# EAGLE design MotorController-ControlCard (EAGLE 8.3.2)
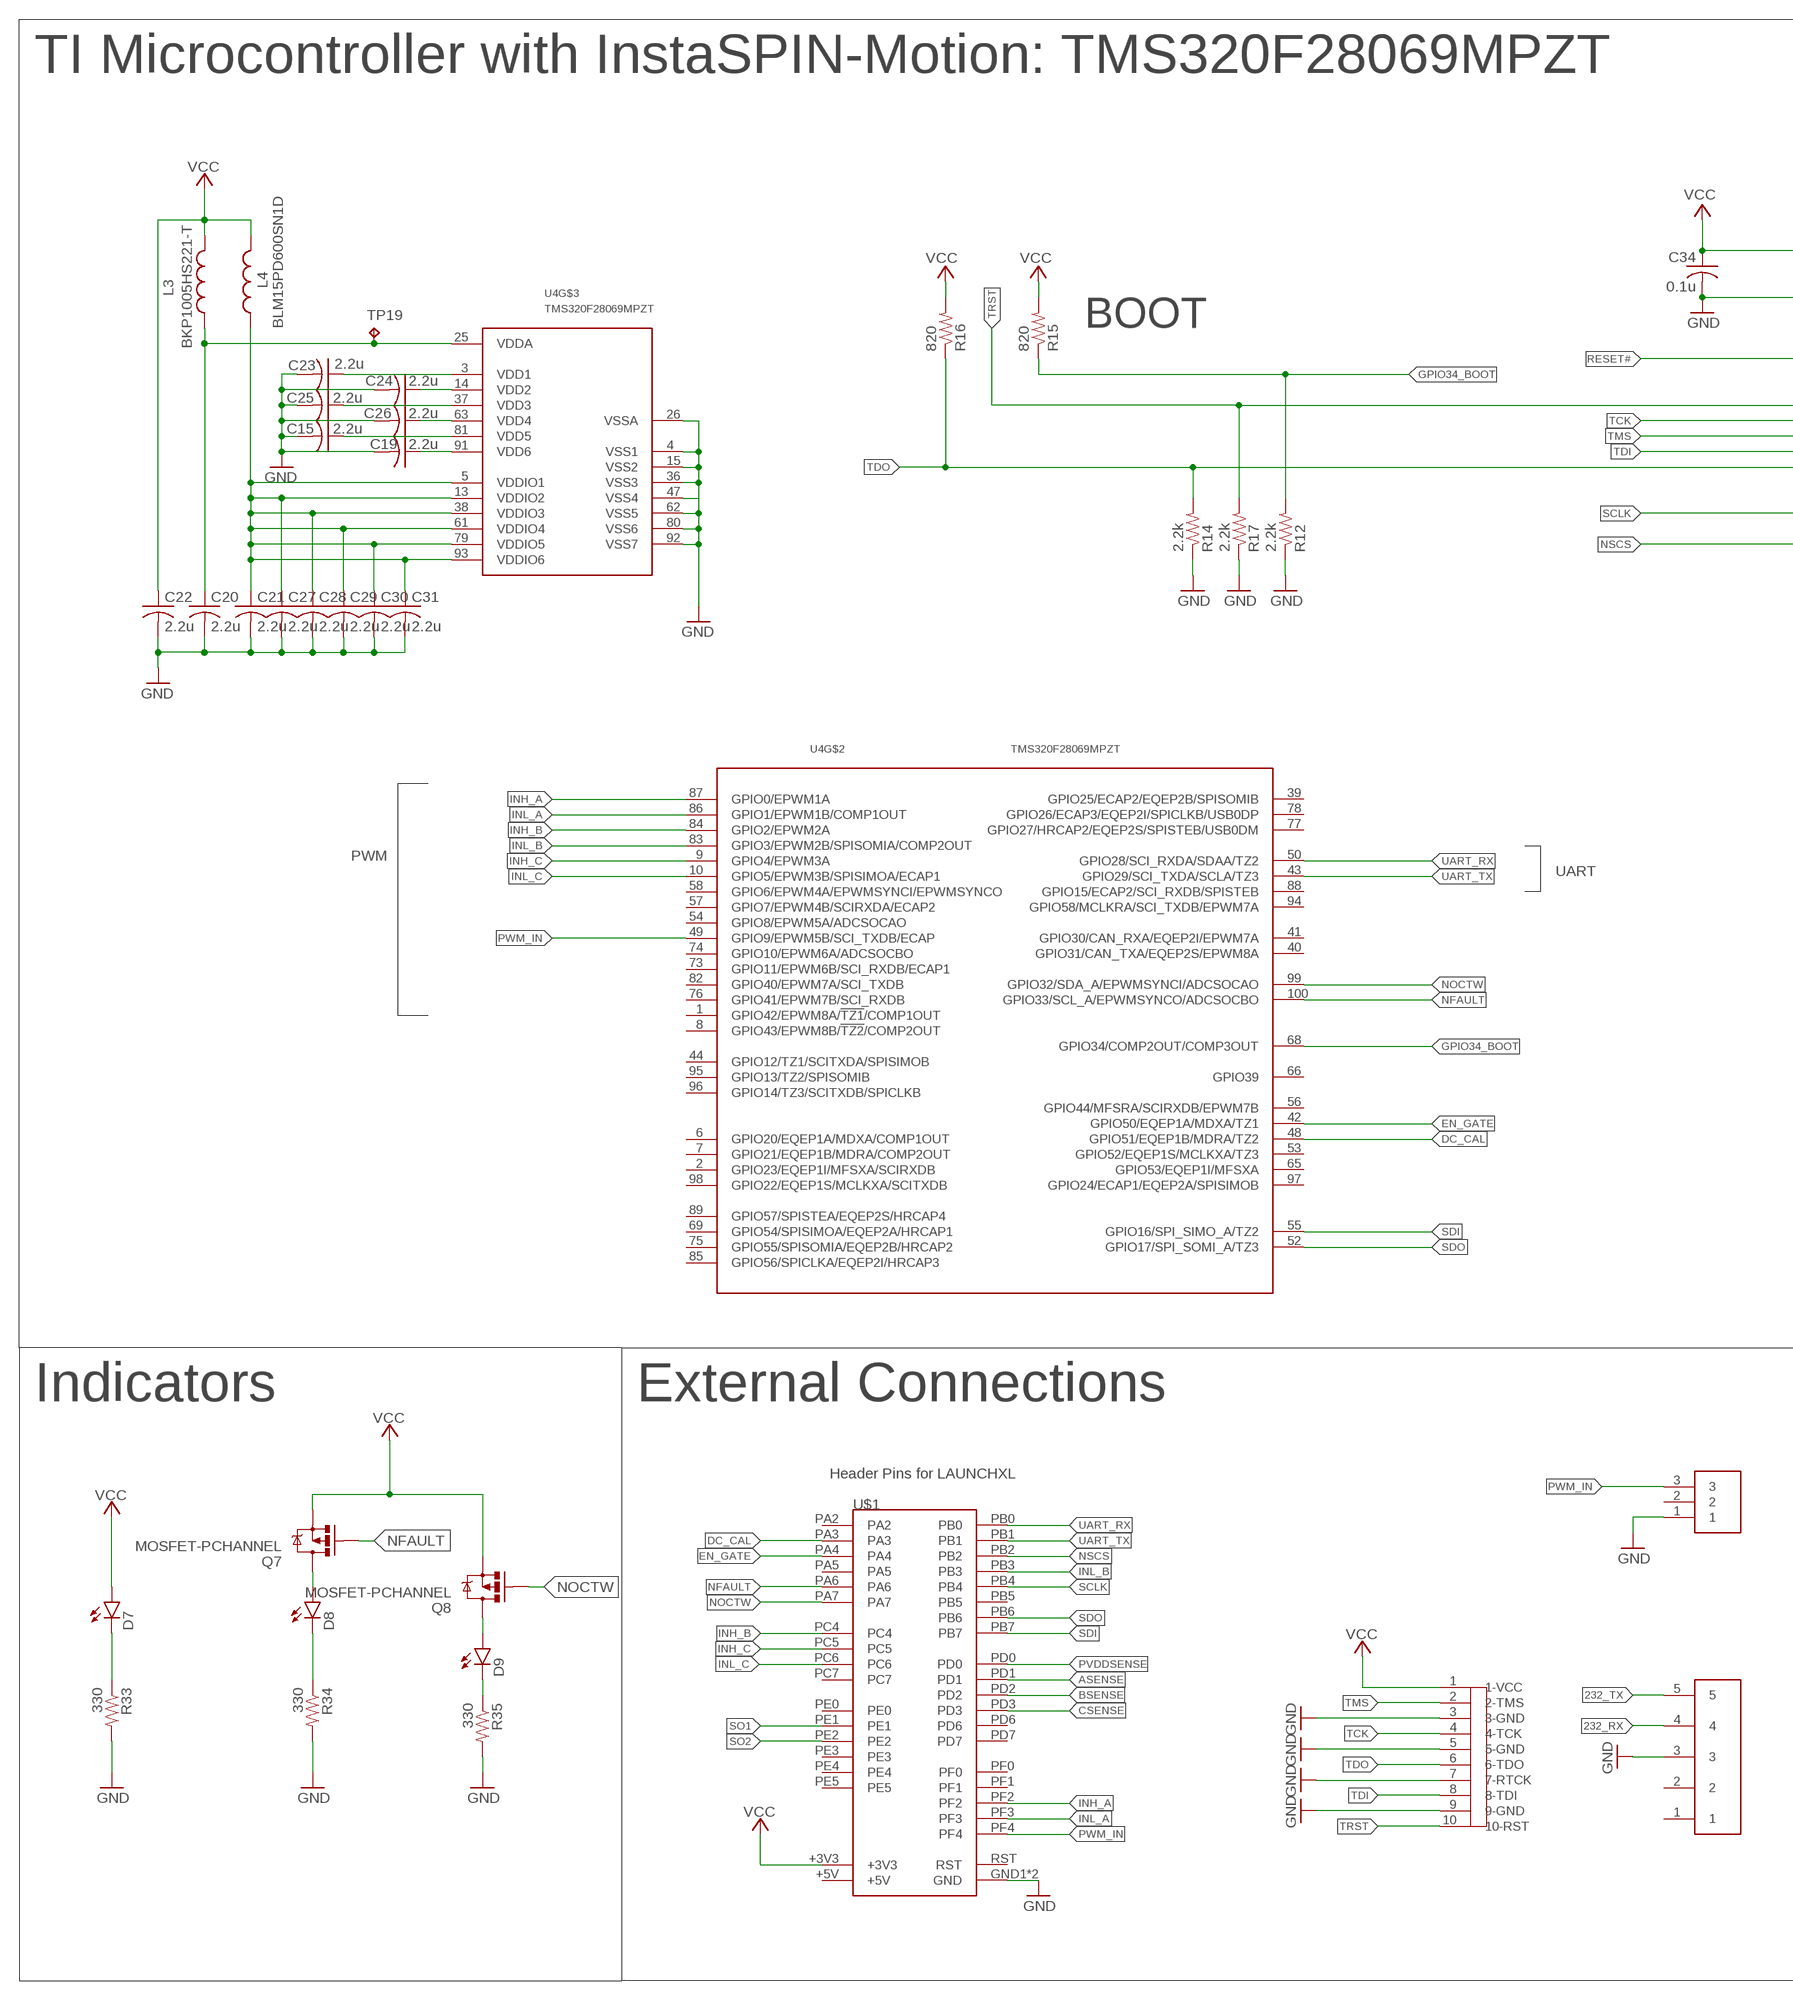
[diagram p0: schematic, sheet 1, part 1 of 2]
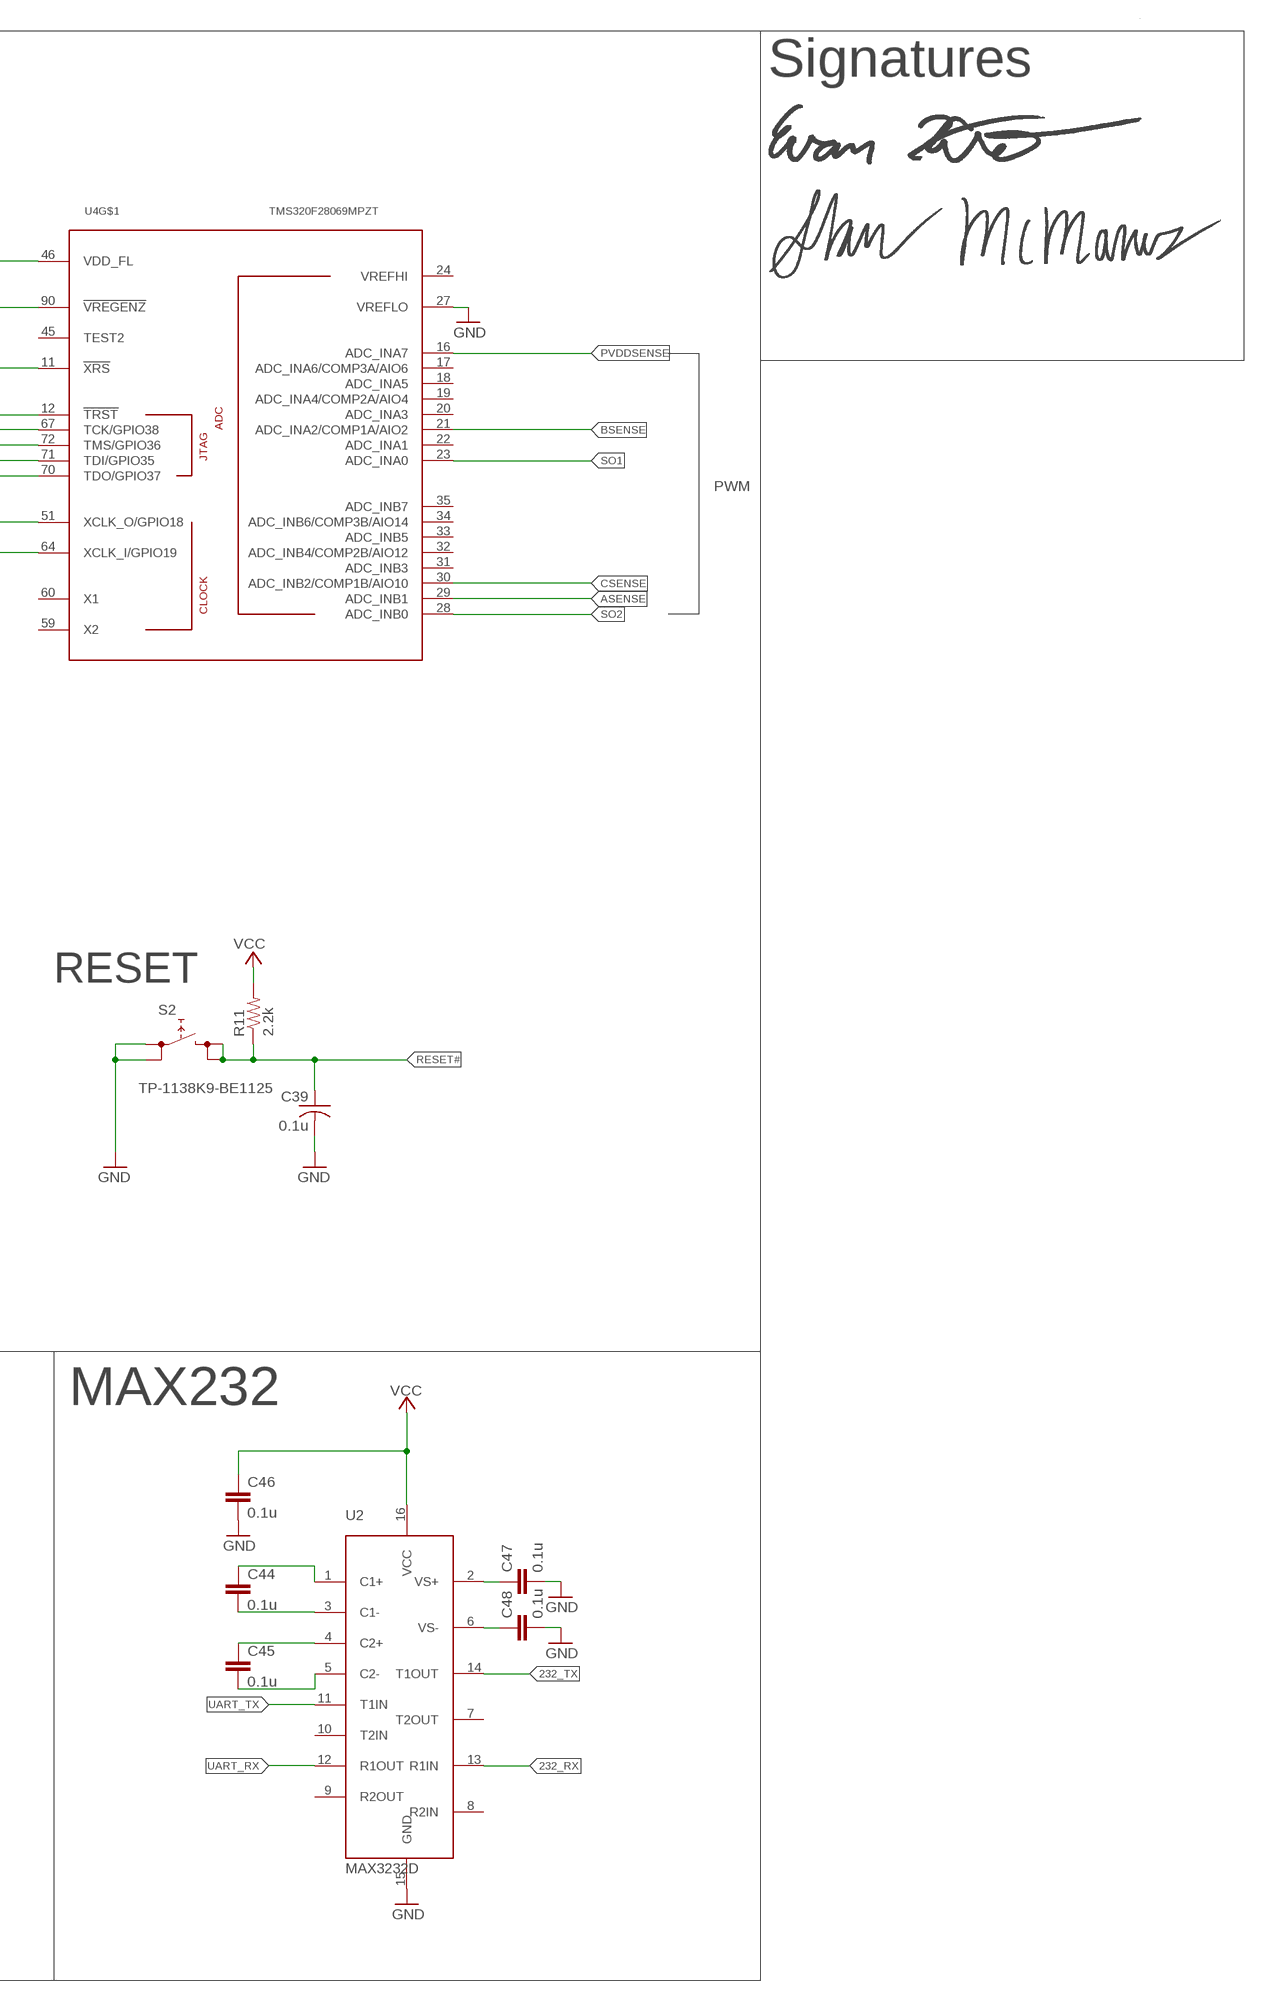
[diagram p1: schematic, sheet 1, part 2 of 2]

## Parts
C15  2.2u  C-USC0402  [C0402]
C19  2.2u  C-USC0402  [C0402]
C20  2.2u  C-USC0402  [C0402]
C21  2.2u  C-USC0402  [C0402]
C22  2.2u  C-USC0402  [C0402]
C23  2.2u  C-USC0402  [C0402]
C24  2.2u  C-USC0402  [C0402]
C25  2.2u  C-USC0402  [C0402]
C26  2.2u  C-USC0402  [C0402]
C27  2.2u  C-USC0402  [C0402]
C28  2.2u  C-USC0402  [C0402]
C29  2.2u  C-USC0402  [C0402]
C30  2.2u  C-USC0402  [C0402]
C31  2.2u  C-USC0402  [C0402]
C34  0.1u  C-USC0402  [C0402]
C39  0.1u  C-USC0402  [C0402]
C44  0.1u  CAP0805  [0805]
C45  0.1u  CAP0805  [0805]
C46  0.1u  CAP0805  [0805]
C47  0.1u  CAP0805  [0805]
C48  0.1u  CAP0805  [0805]
D7  LED1206  [LED-1206]
D8  LED1206  [LED-1206]
D9  LED1206  [LED-1206]
J2  SL03THROUGH_HOLE  [MOLEX_SL_03_TH]
L3  BKP1005HS221-T  L-US0402  [R0402]
L4  BLM15PD600SN1D  L-US0402  [R0402]
Q7  MOSFET-PCHANNEL  [SOT23-3]
Q8  MOSFET-PCHANNEL  [SOT23-3]
R11  2.2k  R-US_R0402  [R0402]
R12  2.2k  R-US_R0402  [R0402]
R14  2.2k  R-US_R0402  [R0402]
R15  820  R-US_R0402  [R0402]
R16  820  R-US_R0402  [R0402]
R17  2.2k  R-US_R0402  [R0402]
R33  330  RESISTOR0805-RES  [0805]
R34  330  RESISTOR0805-RES  [0805]
R35  330  RESISTOR0805-RES  [0805]
S2  TP-1138K9-BE1125  FSMJSMA  [FSMJSMA]
TP19  TESTPAD_TPB1,27  [TESTPAD_B1,27]
U2  MAX3232D  [SOIC16]
U4  TMS320F28069MPZT  TMS320F28069PZSR  [PQFP100]
U$1  TIVA-123  [TIVA-C]
U$2  IDC_BOX_HEADER_2X5_1.27MM  [1.27MM_2X5_BOX_HEADER_STRAIGHT]
U$3  EVAN_HITE_SIGNATURE  [EVAN_HITE_SIGNATURE]
U$4  5PIN  [5PIN]
U$5  SHAUN_MCMANUS_SIGNATURE  [SHAUN_MCMANUS_SIGNATURE]

## Nets
232_RX: U2.13(R1IN) U$4.4
232_TX: U2.14(T1OUT) U$4.5
+3V3: C22.1 C34.1 C46.1 D7.A L3.2 L4.2 Q7.2(S) Q8.2(S) R11.2 R15.2 R16.2 U2.16(VCC) U4.46(VDD_FL) U$1.+3V3 U$2.1(1-VCC) ; supply symbol labelled VCC
ASENSE: U4.29(ADC_INB1) U$1.PD1
BSENSE: U4.21(ADC_INA2/COMP1A/AIO2) U$1.PD2
CSENSE: U4.30(ADC_INB2/COMP1B/AIO10) U$1.PD3
DC_CAL: U4.48(GPIO51/EQEP1B/MDRA/TZ2) U$1.PA3
EN_GATE: U4.42(GPIO50/EQEP1A/MDXA/TZ1) U$1.PA4
GND: C15.2 C19.2 C20.2 C21.2 C22.2 C23.2 C24.2 C25.2 C26.2 C27.2 C28.2 C29.2 C30.2 C31.2 C34.2 C39.2 C46.2 C47.2 C48.2 J2.1 R12.1 R14.1 R17.1 R33.2 R34.2 R35.2 S2.P$1 S2.P$2 U2.15(GND) U4.4(VSS1) U4.15(VSS2) U4.26(VSSA) U4.27(VREFLO) U4.36(VSS3) U4.47(VSS4) U4.62(VSS5) U4.80(VSS6) U4.90(!VREGENZ) U4.92(VSS7) U$1.GND1(GND) U$1.GND2(GND) U$2.3(3-GND) U$2.5(5-GND) U$2.7(7-RTCK) U$2.9(9-GND) U$4.3
GPIO34_BOOT: R12.2 R15.1 U4.68(GPIO34/COMP2OUT/COMP3OUT)
INH_A: U4.87(GPIO0/EPWM1A) U$1.PF2
INH_B: U4.84(GPIO2/EPWM2A) U$1.PC4
INH_C: U4.9(GPIO4/EPWM3A) U$1.PC5
INL_A: U4.86(GPIO1/EPWM1B/COMP1OUT) U$1.PF3
INL_B: U4.83(GPIO3/EPWM2B/SPISOMIA/COMP2OUT) U$1.PB3
INL_C: U4.10(GPIO5/EPWM3B/SPISIMOA/ECAP1) U$1.PC6
N$13: C23.1 U4.3(VDD1)
N$14: C24.1 U4.14(VDD2)
N$15: C25.1 U4.37(VDD3)
N$16: C26.1 U4.63(VDD4)
N$17: C15.1 U4.81(VDD5)
N$24: D7.C R33.1
N$26: D8.C R34.1
N$27: D9.C R35.1
N$28: D9.A Q8.3(D)
N$32: D8.A Q7.3(D)
N$36: C19.1 U4.91(VDD6)
N$40: C44.1 U2.1(C1+)
N$42: C44.2 U2.3(C1-)
N$43: C45.1 U2.4(C2+)
N$44: C45.2 U2.5(C2-)
N$45: C48.1 U2.6(VS-)
N$46: C47.1 U2.2(VS+)
NFAULT: Q7.1(G) U4.100(GPIO33/SCL_A/EPWMSYNCO/ADCSOCBO) U$1.PA6
NOCTW: Q8.1(G) U4.99(GPIO32/SDA_A/EPWMSYNCI/ADCSOCAO) U$1.PA7
NSCS: U4.64(XCLK_I/GPIO19) U$1.PB2
PVDDSENSE: U4.16(ADC_INA7) U$1.PD0
PWM_IN: J2.3 U4.49(GPIO9/EPWM5B/SCI_TXDB/ECAP) U$1.PF4
RESET#: C39.1 R11.1 S2.P$3 S2.P$4 U4.11(!XRS)
SCLK: U4.51(XCLK_O/GPIO18) U$1.PB4
SDI: U4.55(GPIO16/SPI_SIMO_A/TZ2) U$1.PB7
SDO: U4.52(GPIO17/SPI_SOMI_A/TZ3) U$1.PB6
SO1: U4.23(ADC_INA0) U$1.PE1
SO2: U4.28(ADC_INB0) U$1.PE2
TCK: U4.67(TCK/GPIO38) U$2.4(4-TCK)
TDI: U4.71(TDI/GPIO35) U$2.8(8-TDI)
TDO: R14.2 R16.1 U4.70(TDO/GPIO37) U$2.6(6-TDO)
TMS: U4.72(TMS/GPIO36) U$2.2(2-TMS)
TRST: R17.2 U4.12(!TRST) U$2.10(10-RST)
UART_RX: U2.12(R1OUT) U4.50(GPIO28/SCI_RXDA/SDAA/TZ2) U$1.PB0
UART_TX: U2.11(T1IN) U4.43(GPIO29/SCI_TXDA/SCLA/TZ3) U$1.PB1
VDDA: C20.1 L3.1 TP19.TP U4.25(VDDA)
VDDIO: C21.1 C27.1 C28.1 C29.1 C30.1 C31.1 L4.1 U4.5(VDDIO1) U4.13(VDDIO2) U4.38(VDDIO3) U4.61(VDDIO4) U4.79(VDDIO5) U4.93(VDDIO6)
Unconnected: J2.2 U2.7(T2OUT) U2.8(R2IN) U2.9(R2OUT) U2.10(T2IN) U4.1(GPIO42/EPWM8A/!TZ1!/COMP1OUT) U4.2(GPIO23/EQEP1I/MFSXA/SCIRXDB) U4.6(GPIO20/EQEP1A/MDXA/COMP1OUT) U4.7(GPIO21/EQEP1B/MDRA/COMP2OUT) U4.8(GPIO43/EPWM8B/!TZ2!/COMP2OUT) U4.17(ADC_INA6/COMP3A/AIO6) U4.18(ADC_INA5) U4.19(ADC_INA4/COMP2A/AIO4) U4.20(ADC_INA3) U4.22(ADC_INA1) U4.24(VREFHI) U4.31(ADC_INB3) U4.32(ADC_INB4/COMP2B/AIO12) U4.33(ADC_INB5) U4.34(ADC_INB6/COMP3B/AIO14) U4.35(ADC_INB7) U4.39(GPIO25/ECAP2/EQEP2B/SPISOMIB) U4.40(GPIO31/CAN_TXA/EQEP2S/EPWM8A) U4.41(GPIO30/CAN_RXA/EQEP2I/EPWM7A) U4.44(GPIO12/TZ1/SCITXDA/SPISIMOB) U4.45(TEST2) U4.53(GPIO52/EQEP1S/MCLKXA/TZ3) U4.54(GPIO8/EPWM5A/ADCSOCAO) U4.56(GPIO44/MFSRA/SCIRXDB/EPWM7B) U4.57(GPIO7/EPWM4B/SCIRXDA/ECAP2) U4.58(GPIO6/EPWM4A/EPWMSYNCI/EPWMSYNCO) U4.59(X2) U4.60(X1) U4.65(GPIO53/EQEP1I/MFSXA) U4.66(GPIO39) U4.69(GPIO54/SPISIMOA/EQEP2A/HRCAP1) U4.73(GPIO11/EPWM6B/SCI_RXDB/ECAP1) U4.74(GPIO10/EPWM6A/ADCSOCBO) U4.75(GPIO55/SPISOMIA/EQEP2B/HRCAP2) U4.76(GPIO41/EPWM7B/SCI_RXDB) U4.77(GPIO27/HRCAP2/EQEP2S/SPISTEB/USB0DM) U4.78(GPIO26/ECAP3/EQEP2I/SPICLKB/USB0DP) U4.82(GPIO40/EPWM7A/SCI_TXDB) U4.85(GPIO56/SPICLKA/EQEP2I/HRCAP3) U4.88(GPIO15/ECAP2/SCI_RXDB/SPISTEB) U4.89(GPIO57/SPISTEA/EQEP2S/HRCAP4) U4.94(GPIO58/MCLKRA/SCI_TXDB/EPWM7A) U4.95(GPIO13/TZ2/SPISOMIB) U4.96(GPIO14/TZ3/SCITXDB/SPICLKB) U4.97(GPIO24/ECAP1/EQEP2A/SPISIMOB) U4.98(GPIO22/EQEP1S/MCLKXA/SCITXDB) U$1.PA2 U$1.PA5 U$1.PB5 U$1.PC7 U$1.PD6 U$1.PD7 U$1.PE0 U$1.PE3 U$1.PE4 U$1.PE5 U$1.PF0 U$1.PF1 U$4.1 U$4.2

## Notes on the sheet
- TI Microcontroller with InstaSPIN-Motion: TMS320F28069MPZT | Signatures
- BOOT
- PWM
- PWM
- UART
- RESET
- Indicators | External Connections | MAX232
- Header Pins for LAUNCHXL

## Power pins joined to a net without a drawn wire
+5V: U$1.+5V
RST: U$1.RST

## Library data of the parts
C15 C19-C31 C34 C39 = rcl:C-US: CAPACITOR, American symbol
C44-C48 = SparkFun-Passives:CAP: Capacitor Standard 0603 ceramic capacitor, and 0.1" leaded capacitor.
D7-D9 = SparkFun-LED:LED: LEDs Standard schematic elements and footprints for 5mm, 3mm, 1206, and 0603 sized LEDs. 5mm - Spark Fun Electronics SKU : COM-00529 (and others)
J2 = MRDT-Connectors:SL03: Molex 3-pin SL connector Locking 3 pin connector with standard header spacing. Backward compatible with standard RC servo connectors.; ORIENT: HORIZ; PARTNO: 0705550002
L3 L4 = rcl:L-US: INDUCTOR, American symbol
Q7 Q8 = SparkFun-DiscreteSemi:MOSFET-PCHANNEL: Generic PMOSFET IRLML2244 - TRANS-11153 (SOT-23 -20V -4.3A) (1.Gate 2.Source 3.Drain) FQP27P06 - COM-10349 <http://www.sparkfun.com/products/10349> (TO-220 -60V -27A) (1.Gate 2.Source 3.Drain); PROD_ID: TRANS-08285
R11 R12 R14-R17 = rcl:R-US_: RESISTOR, American symbol
R33-R35 = SparkFun-Passives:RESISTOR: Resistor Basic schematic elements and footprints for 0603, 1206, and PTH resistors.
S2 = switch:FSMJSMA
TP19 = RF430FRL152H_EVM_a:TESTPAD_TP: Test pad
U2 = MRDT-ICs:MAX*232; OPERATING_VOLTAGE: 3V3
U4 = LAUNCHXL-F28027:TMS320F28069PZS
U$1 = MRDT-Microcontrollers:TIVA-123: TIVA-C DEV BOARD (NON-CONNECTED)
U$2 = MRDT-Connectors:IDC_BOX_HEADER_2X5_1.27MM: 1175-1733-ND
U$3 = MRDT-Signatures:EVAN_HITE_SIGNATURE
U$4 = Molex-SL:5PIN
U$5 = MRDT-Signatures:SHAUN_MCMANUS_SIGNATURE

## Net classes
0 default: width 0.152 mm, drill 0.305 mm, clearance 0.152 mm

## Board
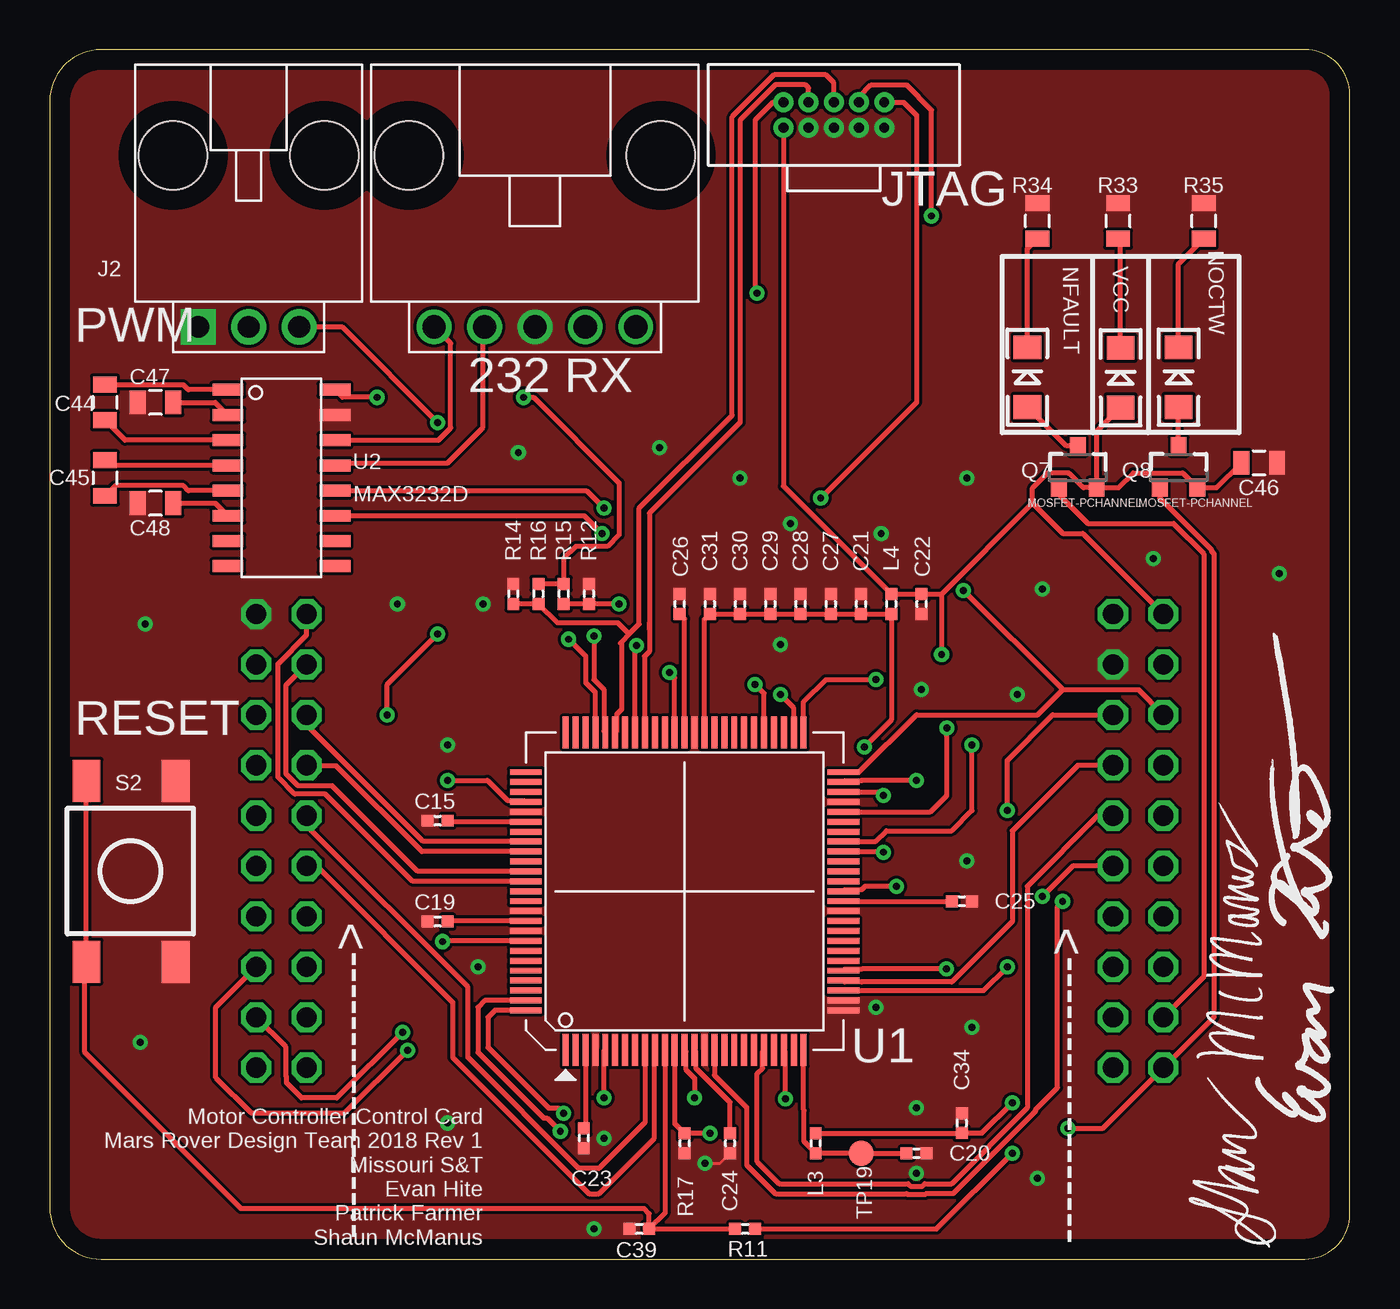
[diagram p2: board, top side]
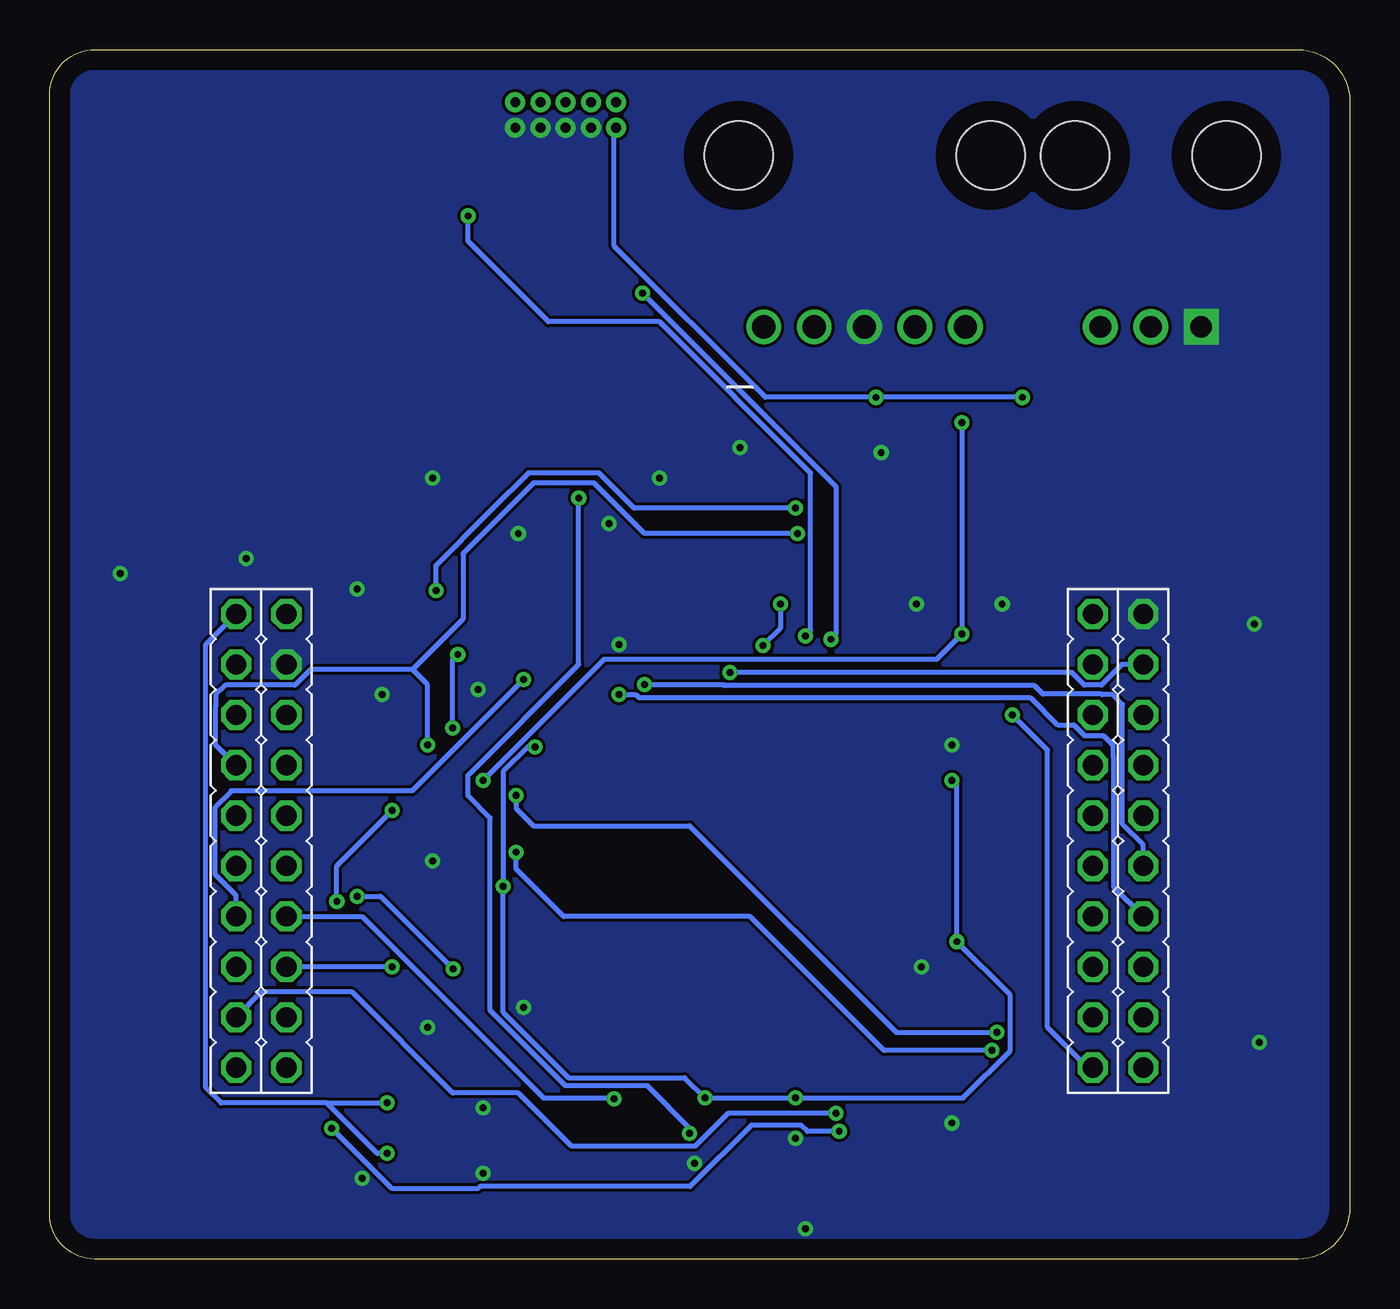
[diagram p3: board, bottom side, seen from below]

Size 65.53 x 60.96 mm. Coordinates in mm from the lower left corner, seen from the top.
Outline: 2.6,0 63.25,0 arc90 65.53,2.29 65.53,58.67 arc90 63.25,60.96 2.6,60.96 arc90 0,58.36 0,2.6 arc90 2.6,0
Copper layers (1*16): Top 0.035mm / dielectric 1.5mm / Bottom 0.035mm
Design rules "advanced_circuits_standard": minimum track width 5mil, minimum drill 10mil, track to track 5mil, track to pad 5mil, pad to pad 5mil, via to via 5mil, smd to smd 5mil, copper to edge 40mil, drill to drill 5mil, minimum pad ring 10mil, minimum via ring 8mil, stop-mask expansion 4mil, vias tented up to drill 0mil, thermal gap 10mil

### Footprints (pad centres in the part's own frame; a part is rotated, then mirrored left to right if it is on the bottom)
C0402 = smd 0.6 x 0.6: 1 -0.5,0; 2 0.5,0
0805 = smd 0.8 x 1.2: 1 -0.9,0; 2 0.9,0
LED-1206 = smd 1.2 x 1.4: A -1.5,0; C 1.5,0
MOLEX_SL_03_TH = drill 1.092 pad 1.778 square: 1 -2.54,0 | drill 1.092 pad 1.778: 2 0,0; 3 2.54,0 | hole 3.454: -3.81,8.636; 3.81,8.636
R0402 = smd 0.6 x 0.6: 1 -0.5,0; 2 0.5,0
SOT23-3 = smd 0.8 x 0.9: 1 -0.95,-1; 2 0.95,-1; 3 0,1.1
FSMJSMA = smd 1.397 x 2.108: P$1 0,0; P$2 0,-9.119; P$3 4.496,0; P$4 4.496,-9.119
TESTPAD_B1,27 = smd 1.27 x 1.27: TP 0,0
SOIC16 = smd 0.6 x 1.55: 1 -4.445,-2.7; 2 -3.175,-2.7; 3 -1.905,-2.7; 4 -0.635,-2.7; 5 0.635,-2.7; 6 1.905,-2.7; 7 3.175,-2.7; 8 4.445,-2.7; 9 4.445,2.7; 10 3.175,2.7; 11 1.905,2.7; 12 0.635,2.7; 13 -0.635,2.7; 14 -1.905,2.7; 15 -3.175,2.7; 16 -4.445,2.7
PQFP100 = smd 1.6 x 0.3: 1 -8,6; 2 -8,5.5; 3 -8,5; 4 -8,4.5; 5 -8,4; 6 -8,3.5; 7 -8,3; 8 -8,2.5; 9 -8,2; 10 -8,1.5; 11 -8,1; 12 -8,0.5; 13 -8,0; 14 -8,-0.5; 15 -8,-1; 16 -8,-1.5; 17 -8,-2; 18 -8,-2.5; 19 -8,-3; 20 -8,-3.5; 21 -8,-4; 22 -8,-4.5; 23 -8,-5; 24 -8,-5.5; 25 -8,-6; 51 8,-6; 52 8,-5.5; 53 8,-5; 54 8,-4.5; 55 8,-4; 56 8,-3.5; 57 8,-3; 58 8,-2.5; 59 8,-2; 60 8,-1.5; 61 8,-1; 62 8,-0.5; 63 8,0; 64 8,0.5; 65 8,1; 66 8,1.5; 67 8,2; 68 8,2.5; 69 8,3; 70 8,3.5; 71 8,4; 72 8,4.5; 73 8,5; 74 8,5.5; 75 8,6 | smd 0.3 x 1.6: 26 -6,-8; 27 -5.5,-8; 28 -5,-8; 29 -4.5,-8; 30 -4,-8; 31 -3.5,-8; 32 -3,-8; 33 -2.5,-8; 34 -2,-8; 35 -1.5,-8; 36 -1,-8; 37 -0.5,-8; 38 0,-8; 39 0.5,-8; 40 1,-8; 41 1.5,-8; 42 2,-8; 43 2.5,-8; 44 3,-8; 45 3.5,-8; 46 4,-8; 47 4.5,-8; 48 5,-8; 49 5.5,-8; 50 6,-8; 76 6,8; 77 5.5,8; 78 5,8; 79 4.5,8; 80 4,8; 81 3.5,8; 82 3,8; 83 2.5,8; 84 2,8; 85 1.5,8; 86 1,8; 87 0.5,8; 88 0,8; 89 -0.5,8; 90 -1,8; 91 -1.5,8; 92 -2,8; 93 -2.5,8; 94 -3,8; 95 -3.5,8; 96 -4,8; 97 -4.5,8; 98 -5,8; 99 -5.5,8; 100 -6,8
TIVA-C = drill 1.016 octagon: +3V3 30.48,2.54; +5V 30.48,5.08; GND1 33.02,5.08; GND2 30.48,48.26; PA2 53.34,48.26; PA3 50.8,48.26; PA4 48.26,48.26; PA5 48.26,2.54; PA6 50.8,2.54; PA7 53.34,2.54; PB0 35.56,2.54; PB1 38.1,2.54; PB2 33.02,48.26; PB3 35.56,45.72; PB4 45.72,2.54; PB5 33.02,2.54; PB6 45.72,48.26; PB7 43.18,48.26; PC4 38.1,45.72; PC5 40.64,45.72; PC6 43.18,45.72; PC7 45.72,45.72; PD0 35.56,5.08; PD1 38.1,5.08; PD2 40.64,5.08; PD3 43.18,5.08; PD6 48.26,45.72; PD7 50.8,45.72; PE0 35.56,48.26; PE1 45.72,5.08; PE2 48.26,5.08; PE3 50.8,5.08; PE4 40.64,2.54; PE5 43.18,2.54; PF0 38.1,48.26; PF1 53.34,5.08; PF2 30.48,45.72; PF3 33.02,45.72; PF4 53.34,45.72; RST 40.64,48.26
1.27MM_2X5_BOX_HEADER_STRAIGHT = drill 0.5: 1 1.915,8.865; 2 3.185,8.865; 3 1.915,7.595; 4 3.185,7.595; 5 1.915,6.325; 6 3.185,6.325; 7 1.915,5.055; 8 3.185,5.055; 9 1.915,3.785; 10 3.185,3.785
5PIN = drill 1.168: 1 5.08,0; 2 2.54,0; 3 0,0; 4 -2.54,0; 5 -5.08,0 | hole 3.454: -6.35,8.636; 6.35,8.636

### Placement (x,y rotation side)
C15  19.56,22.1 180 top
C19  19.56,17.02 180 top
C20  43.69,5.33 0 top
C21  40.89,33.02 90 top
C22  43.94,33.02 270 top
C23  26.92,6.1 270 top
C24  34.29,5.84 270 top
C25  45.97,18.03 0 top
C26  31.75,33.02 90 top
C27  39.37,33.02 90 top
C28  37.85,33.02 90 top
C29  36.32,33.02 90 top
C30  34.8,33.02 90 top
C31  33.27,33.02 90 top
C34  45.97,6.86 90 top
C39  29.72,1.52 180 top
C44  2.79,43.18 270 top
C45  2.79,39.37 270 top
C46  60.96,40.13 0 top
C47  5.33,43.18 180 top
C48  5.33,38.1 180 top
D7  53.97,44.42 90 top
D8  49.28,44.45 90 top
D9  56.9,44.45 90 top
J2  10.03,46.99 0 top
L3  38.61,5.84 90 top
L4  42.42,33.02 90 top
Q7  51.82,39.88 0 top
Q8  56.9,39.88 0 top
R11  35.05,1.52 0 top
R12  27.18,33.53 270 top
R14  23.37,33.53 270 top
R15  25.91,33.53 90 top
R16  24.64,33.53 90 top
R17  32,5.84 90 top
R33  53.85,52.32 90 top
R34  49.78,52.32 90 top
R35  58.17,52.32 90 top
S2  6.35,14.99 180 top
TP19  40.89,5.33 270 top
U2  11.68,39.37 270 top
U4  32,18.54 90 top
U$1  58.67,62.99 270 bottom
U$2  45.85,55.12 90 top
U$3  65.53,6.86 90 top
U$4  24.46,46.99 0 top
U$5  62.74,-0.25 90 top

### Tracks (layer width: path | path; a pad name or v marks a point on that pad's centre or on a via)
232_RX
  Top 0.254: U2.13 14.51,40.13 20.07,40.13 21.84,41.91 21.84,46.91 U$4.4
232_TX
  Top 0.254: U2.14 19.6,41.27 20.22,41.89 20.22,46.16 U$4.5
+3V3  (via drill 0.35)
  Top 0.254: R16.2 R15.2 25.91,35.31 26.52,35.92 28.11,35.92 28.7,36.51 28.7,39.12 24.38,43.43 v23.88,43.43 | v16.51,43.43 14.77,43.43 U2.16 | Q7.2 52.77,41.72 D7.A | C46.1 58.81,38.88 Q8.2 57.1,39.62 54.61,39.62 53.86,38.88 Q7.2 | Q7.2 52.11,38.88 51.38,39.61 51.33,39.61 51.31,39.62 50.29,39.62 49.53,38.86 49.53,38.1 | 49.53,38.1 51.05,36.58 52.07,36.58 U$1.+3V3 | 44.96,33.53 44.95,33.52 C22.1 L4.2 36.98,38.96 U$2.1 | 44.96,33.53 49.53,38.1 | U4.46 44.39,22.54 45.21,23.37 v45.21,26.77 | v44.96,30.48 44.96,33.53 | v48.51,7.87 47,6.36 C34.1 45.96,6.34 L3.2 | R11.2 44.7,1.52 v48.51,5.33
  Bottom 0.254: v16.51,43.43 v23.88,43.43 29.46,43.43 37.08,51.05 37.08,56.93 U$2.1 | v45.21,26.77 45.21,30.23 v44.96,30.48 | 51.56,7.87 v48.51,7.87 | 51.56,7.87 56.9,7.87 57.66,8.64 57.66,30.99 U$1.+3V3 | v48.51,5.33 49.02,5.33 51.56,7.87
ASENSE
  Top 0.254: U$1.PD1 51.82,24.89 48.51,21.59 48.51,17.02 45.47,13.97 40.92,13.97 40.08,13.97 U4.29
BSENSE
  Top 0.254: U$1.PD2 52.83,22.35 49.28,18.8 49.28,7.62 45.47,3.81 44.11,3.81 43.96,3.66 43.42,3.66 43.27,3.81 36.76,3.81 35.66,4.91 35.66,9.35 35.93,9.63 35.93,10.47 U4.21
CSENSE  (via drill 0.35)
  Top 0.254: U$1.PD3 51.56,19.81 v50.04,18.29 | v45.19,14.63 40.94,14.63 40.92,14.61 40.08,14.61 U4.30
  Bottom 0.254: v50.04,18.29 48.85,18.29 v45.19,14.63
DC_CAL  (via drill 0.35)
  Top 0.254: U4.48 41.84,23.54 v42.01,23.37 | v17.78,11.43 14.48,8.13 12.7,8.13 11.94,8.89 11.94,9.2 11.91,9.22 11.91,10.69 U$1.PA3
  Bottom 0.254: v42.01,23.37 42.01,22.71 41.15,21.84 33.27,21.84 22.86,11.43 v17.78,11.43
EN_GATE  (via drill 0.35)
  Top 0.254: U4.42 41.98,20.54 v42.01,20.51 | U$1.PA4 8.38,12.7 8.38,9.14 10.16,7.37 14.88,7.37 v18.03,10.52
  Bottom 0.254: v42.01,20.51 42.01,19.66 39.62,17.27 30.23,17.27 23.47,10.52 v18.03,10.52
GND  (via drill 0.35)
  Top 0.152: v33.02,4.83 33.77,4.83 C24.2
  other vias: 27.94,6.1 27.43,1.52 43.69,7.62 43.69,4.32 49.78,4.06 23.62,40.64 30.73,40.89 34.8,39.37 46.23,39.37 41.91,36.58 55.63,35.31 61.98,34.54 43.94,28.7 48.77,28.45 46.23,20.07 46.48,11.68 20.07,6.86 21.59,14.73 20.07,25.91 17.53,33.02 4.83,32 4.57,10.92 50.04,33.78 41.66,12.7 36.83,30.99 37.34,37.08 21.84,33.02
  pour Top (no thermals): -76.71,75.95 108.71,75.95 108.71,-53.34 -76.71,-53.34
  pour Bottom (no thermals): -109.47,-74.93 131.83,-74.17 133.1,87.63 -108.2,86.87
GPIO34_BOOT  (via drill 0.35)
  Top 0.254: R15.1 R12.2 v28.7,33.02 | 29.61,30.88 29.76,30.74 | 29.61,30.88 v29.57,30.92 | U4.68 29.5,30.77 29.61,30.88
  Bottom 0.254: v28.7,33.02 28.7,31.79 v29.57,30.92
INH_A
  Top 0.254: U4.87 18.3,19.04 13.89,23.44 12.35,23.44 11.51,24.29 11.51,30 12.95,31.45 U$1.PF2
INH_B
  Top 0.254: U4.84 18.76,20.54 14.45,24.86 12.99,24.86 U$1.PC4
INH_C
  Top 0.254: U4.9 30,6.89 27.69,4.57 26.67,4.57 21.08,10.16 21.08,13.72 12.95,21.84 U$1.PC5
INL_A
  Top 0.254: U4.86 18.56,19.54 14.25,23.85 12.52,23.85 11.91,24.46 11.91,28.93 12.45,29.46 12.57,29.59 U$1.PF3
INL_B
  Top 0.254: U$1.PB3 12.95,26.92 18.8,21.08 23.96,21.08 U4.83
INL_C
  Top 0.254: U$1.PC6 13.46,19.81 20.32,12.95 20.32,10.16 27.18,3.3 27.69,3.3 30.48,6.1 30.48,10.52 U4.10
N$13
  Top 0.254: U4.3 27,6.68 C23.1
N$14
  Top 0.254: U4.14 32.58,10.47 32.58,9.63 34.29,7.91 C24.1
N$15
  Top 0.254: U4.37 45.47,18.04 C25.1
N$16
  Top 0.254: U4.63 32,32.27 C26.1
N$17
  Top 0.254: U4.81 20.11,22.04 C15.1
N$24
  Top 0.254: D7.C 53.97,51.3 R33.1
N$26
  Top 0.254: D8.C 49.28,50.92 R34.1
N$27
  Top 0.254: D9.C 56.9,50.15 R35.1
N$28
  Top 0.254: Q8.3 D9.A
N$32
  Top 0.254: Q7.3 51.25,40.98 D8.A
N$36
  Top 0.254: U4.91 20.08,17.04 C19.1
N$40
  Top 0.254: U2.1 6.99,43.82 6.75,44.06 2.81,44.06 C44.1
N$42
  Top 0.254: U2.3 3.8,41.27 C44.2
N$43
  Top 0.254: U2.4 3.06,40.01 C45.1
N$44
  Top 0.254: U2.5 6.99,38.74 6.75,38.98 3.3,38.98 C45.2
N$45
  Top 0.254: C48.1 8.35,38.1 U2.6
N$46
  Top 0.254: C47.1 8.35,43.18 U2.2
NFAULT  (via drill 0.35)
  Top 0.254: Q7.1 50.87,38.54 52.32,37.08 56.64,37.08 58.17,35.56 58.17,14.22 U$1.PA6 | U4.100 22.45,12.54 22.1,12.19 22.1,10.67 25.15,7.62 25.63,7.62 v25.91,7.34
  Bottom 0.254: v25.91,7.34 31.35,7.34 33,5.69 39.22,5.69 41.91,8.38 45.21,8.38 50.29,13.46 54.86,13.46 U$1.PA6
NOCTW  (via drill 0.35)
  Top 0.254: Q8.1 55.95,38.35 58.57,35.73 58.57,35.66 58.67,35.56 58.67,12.19 56.26,9.78 | 56.26,9.78 U$1.PA7 | U4.99 21.93,13.04 21.59,12.7 21.59,10.41 24.89,7.11 25.06,7.11 v25.74,6.43 | v51.31,6.6 53.09,6.6 56.26,9.78
  Bottom 0.254: v25.74,6.43 27.35,6.43 27.67,6.75 30.16,6.75 33.26,3.66 43.84,3.66 43.94,3.56 48.26,3.56 v51.31,6.6
NSCS  (via drill 0.35)
  Top 0.254: U4.64 31.5,29.31 v31.24,29.57
  Bottom 0.254: U$1.PB2 11.48,29.97 12.52,28.93 13.39,28.93 14.02,29.57 v31.24,29.57
PVDDSENSE  (via drill 0.35)
  Top 0.254: U$1.PD0 50.55,27.43 48.26,25.15 v48.26,22.61 | U4.16 33.5,9.27 35.12,7.65 35.12,4.76 36.58,3.3 43.2,3.3 43.25,3.25 44.13,3.25 44.18,3.3 45.53,3.3 49.68,7.45 49.68,7.52 50.8,8.64 50.8,17.78 v51.05,18.03
  Bottom 0.254: v51.05,18.03 51.05,19.81 v48.26,22.61
PWM_IN  (via drill 0.35)
  Top 0.254: J2.3 14.73,46.99 v19.56,42.16 | v43.69,24.13 40.94,24.13 40.92,24.11 40.08,24.11 U4.49 | v17.02,27.43 17.02,28.96 v19.56,31.5
  Bottom 0.254: v19.56,42.16 v19.56,31.5 20.83,30.23 37.59,30.23 v43.69,24.13 | U$1.PF4 13.21,9.65 15.24,11.68 15.24,25.65 v17.02,27.43
RESET#
  Top 0.254: S2.P$4 S2.P$3 1.78,14.91 1.78,10.41 9.65,2.54 29.97,2.54 30.22,2.29 C39.1 | U4.11 31,2.31 C39.1 | C39.1 R11.1
SCLK  (via drill 0.35)
  Top 0.254: U4.51 38,28.1 39.12,29.21 v41.66,29.21
  Bottom 0.254: U$1.PB4 56.13,18.34 57.17,19.38 57.17,22.78 56.39,23.57 56.39,23.62 47.24,23.62 v41.66,29.21
SDI  (via drill 0.35)
  Top 0.254: U4.55 36,28.51 v35.56,28.96
  Bottom 0.254: v35.56,28.96 31.56,28.96 31.51,28.91 15.91,28.91 15.47,28.47 12.52,28.47 12.5,28.45 11.94,28.45 11.45,27.96 11.45,21.92 10.41,20.88 U$1.PB7
SDO  (via drill 0.35)
  Top 0.254: U4.52 37.5,27.77 v36.83,28.45
  Bottom 0.254: v36.83,28.45 35.98,28.45 35.83,28.3 16.11,28.3 14.73,26.92 13.92,26.92 13.39,26.39 12.42,26.39 11.94,25.91 11.94,25.35 11.91,25.32 11.91,18.77 U$1.PB6
SO1  (via drill 0.35)
  Top 0.254: v37.08,8.08 37.08,9.62 37.08,9.63 37.08,10.47 U4.23
  Bottom 0.254: U$1.PE1 49.78,17.27 40.64,8.13 37.13,8.13 v37.08,8.08
SO2  (via drill 0.35)
  Top 0.254: U4.28 47.07,13.54 v48.26,14.73
  Bottom 0.254: v48.26,14.73 U$1.PE2
TCK
  Top 0.254: U$2.4 38.25,59.03 38.1,59.18 36.58,59.18 34.8,57.4 34.8,42.16 30.23,37.59 30.23,31.75 | U4.67 29.97,26.57 29.97,30.37 30.23,30.63 30.23,31.75 | 30.23,31.75 30.23,32.07
TDI  (via drill 0.35)
  Top 0.254: U$2.8 40.79,58.57 41.4,59.18 43.18,59.18 44.45,57.91 v44.45,52.58 | v27.43,31.42 27.43,29.21 27.94,28.7 27.94,26.61 U4.71
  Bottom 0.254: v44.45,52.58 44.45,51.31 40.39,47.24 34.8,47.24 27.18,39.62 27.18,31.67 v27.43,31.42
TDO
  Top 0.254: U$2.6 39.52,59.28 39.12,59.69 36.51,59.69 34.39,57.57 34.39,42.52 29.72,37.85 29.72,32 29.21,31.5 | 29.21,31.5 28.83,31.12 | 28.83,31.12 28.76,31.04 | R14.2 R16.1 25.59,32.07 28.63,32.07 29.21,31.5 | U4.70 28.58,26.61 28.58,27.46 28.83,27.71 28.83,31.12
TMS  (via drill 0.35)
  Top 0.254: U$2.2 36.46,58.3 35.56,57.4 35.56,48.77 v35.64,48.68 | U4.72 27.5,28.56 27.03,29.04 27.03,30.38 v26.16,31.24
  Bottom 0.254: v35.64,48.68 25.91,38.95 25.91,31.5 v26.16,31.24
TRST  (via drill 0.35)
  Top 0.254: U$2.10 43.04,58.3 43.69,57.66 43.69,43.18 v38.86,38.35 | U4.12 31.5,6.84 R17.2 v33.27,6.35
  Bottom 0.254: v38.86,38.35 38.86,29.97 44.45,24.38 44.45,23.37 43.33,22.25 43.33,12.53 39.54,8.74 35.41,8.74 33.27,6.6 v33.27,6.35
UART_RX  (via drill 0.35)
  Top 0.254: U2.12 27.05,38.74 v27.94,37.85 | U4.50 40.8,24.54 43.69,27.43 49.78,27.43 51.05,28.7 | U$1.PB0 54.86,28.7 51.05,28.7 | 51.05,28.7 v46.06,33.7
  Bottom 0.254: v27.94,37.85 36.07,37.85 37.85,39.62 41.4,39.62 43.18,37.85 43.43,37.59 46.06,34.97 v46.06,33.7
UART_TX  (via drill 0.35)
  Top 0.254: U2.11 26.95,37.46 v27.84,36.58 | U4.43 41.62,21.04 42.16,21.59 45.47,21.59 46.48,22.61 v46.48,25.91
  Bottom 0.254: v27.84,36.58 35.56,36.58 38.1,39.12 41.15,39.12 44.7,35.56 44.7,32.26 47.24,29.72 | U$1.PB1 57.17,25.93 57.17,27.86 57.15,27.89 57.15,28.45 56.67,28.93 53.16,28.93 52.38,29.72 47.24,29.72 | v46.48,25.91 46.48,28.96 47.24,29.72
VDDA
  Top 0.254: U4.25 38,7.52 38.03,7.5 38.03,5.93 L3.1 40.89,5.34 TP19.TP C20.1
VDDIO  (via drill 0.35)
  Top 0.254: U4.61 33,32.25 C31.1 C30.1 C29.1 C28.1 C27.1 C21.1 L4.1 42.42,27.18 v41.06,25.82 | U4.93 19.85,16.04 v19.81,16 | U4.79 23.93,23.11 23.09,23.11 22.07,24.13 v20.07,24.13 | U4.38 40.08,18.61 40.92,18.61 41.1,18.8 v42.67,18.8 | v32.51,8.13 32.51,9.11 32.08,9.55 32.08,10.47 U4.13 | v27.94,8.13 27.94,10.48 U4.5
  Bottom 0.254: v20.07,24.13 19.81,23.88 v19.81,16 17.12,13.31 17.12,10.5 19.5,8.13 v27.94,8.13 v32.51,8.13 33.53,9.14 39.37,9.14 42.67,12.45 v42.67,18.8 42.67,24.57 41.42,25.82 v41.06,25.82

### Text on the board
tPlace: JTAG | NFAULT | VCC | PWM | NOCTW | 232 RX | RESET | U1 | Motor Controller Control Card / Mars Rover Design Team 2018 Rev 1 / Missouri S&T / Evan Hite / Patrick Farmer / Shaun McManus | ------------------> | ------------------>